# EAGLE design biochem_M_V2 (EAGLE 9.6.2)
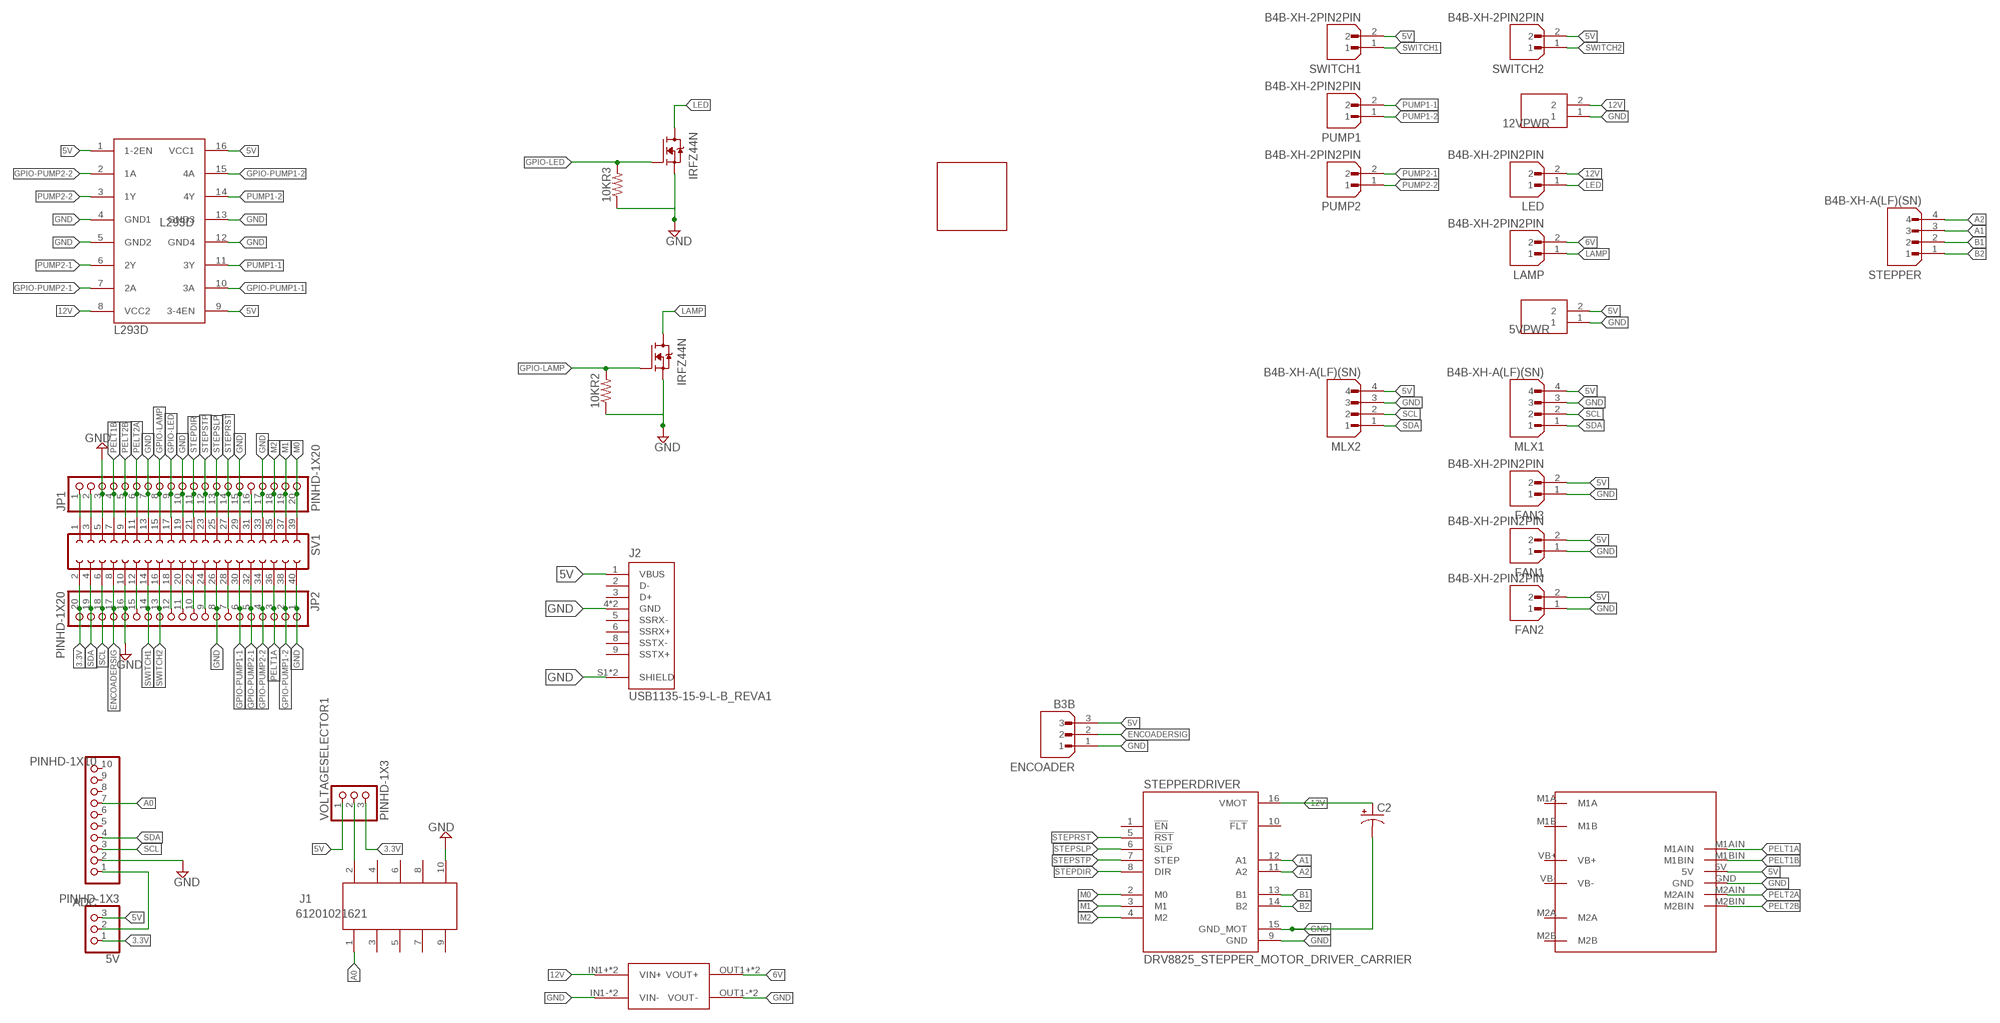
[diagram p0: schematic, sheet 1]

## Parts
5V  PINHD-1X3  [1X03]
5VPWR  TB010-508-02BE  [CUI_TB010-508-02BE]
10KR2  R-US_0204/7  [0204/7]
10KR3  R-US_0204/7  [0204/7]
12VPWR  TB010-508-02BE  [CUI_TB010-508-02BE]
ADC  PINHD-1X10  [1X10]
C2  CPOL-USB45181A  [B45181A]
ENCOADER  B3B  [B3B]
FAN1  B4B-XH-2PIN2PIN  [B4BXH2]
FAN2  B4B-XH-2PIN2PIN  [B4BXH2]
FAN3  B4B-XH-2PIN2PIN  [B4BXH2]
J1  61201021621  [61201021621]
J2  USB1135-15-9-L-B_REVA1  [GCT_USB1135-15-9-L-B_REVA1]
JP1  PINHD-1X20  [1X20]
JP2  PINHD-1X20  [1X20]
L293D  L293D  [DIL16]
LAMP  B4B-XH-2PIN2PIN  [B4BXH2]
LED  B4B-XH-2PIN2PIN  [B4BXH2]
MLX1  B4B-XH-A(LF)(SN)  [JST_B4B-XH-A(LF)(SN)]
MLX2  B4B-XH-A(LF)(SN)  [JST_B4B-XH-A(LF)(SN)]
PUMP1  B4B-XH-2PIN2PIN  [B4BXH2]
PUMP2  B4B-XH-2PIN2PIN  [B4BXH2]
Q4-T  IRFZ44N  [TO254P1016X419X2286-3]
Q4-T4  IRFZ44N  [TO254P1016X419X2286-3]
STEPPER  B4B-XH-A(LF)(SN)  [JST_B4B-XH-A(LF)(SN)]
STEPPERDRIVER  DRV8825_STEPPER_MOTOR_DRIVER_CARRIER  [IC_DRV8825_STEPPER_MOTOR_DRIVER_CARRIER]
SV1  FE20-2  [FE20-2]
SWITCH1  B4B-XH-2PIN2PIN  [B4BXH2]
SWITCH2  B4B-XH-2PIN2PIN  [B4BXH2]
U$1  MP1584  [DC-BRICK]
U$2  MDD3A  [FOOTPRINT]
U$3  QRBIOS  [GITQRBIOSPECTRONICS]
VOLTAGESELECTOR1  PINHD-1X3  [1X03]

## Nets
3.3V [power]: 5V.1 JP2.20 SV1.2 VOLTAGESELECTOR1.3
5V [power]: 5V.3 5VPWR.2 ENCOADER.3 FAN1.2 FAN2.2 FAN3.2 J2.1(VBUS) L293D.1(1-2EN) L293D.9(3-4EN) L293D.16(VCC1) MLX1.4 MLX2.4 SWITCH1.2 SWITCH2.2 U$2.5V VOLTAGESELECTOR1.1
6V: LAMP.2 U$1.OUT1+(VOUT+) U$1.OUT2+(VOUT+)
12V [power]: 12VPWR.2 C2.+ L293D.8(VCC2) LED.2 STEPPERDRIVER.16(VMOT) U$1.IN1+(VIN+) U$1.IN2+(VIN+)
A0: ADC.7 J1.1
A1: STEPPER.3 STEPPERDRIVER.12(A1)
A2: STEPPER.4 STEPPERDRIVER.11(A2)
B1: STEPPER.2 STEPPERDRIVER.13(B1)
B2: STEPPER.1 STEPPERDRIVER.14(B2)
ENCOADERSIG: ENCOADER.2 JP2.17 SV1.8
GND: 5VPWR.1 10KR2.1 10KR3.1 12VPWR.1 ADC.2 C2.- ENCOADER.1 FAN1.1 FAN2.1 FAN3.1 J1.10 J2.4(GND) J2.7(GND) J2.S1(SHIELD) J2.S2(SHIELD) JP1.3 JP1.7 JP1.10 JP1.15 JP1.17 JP2.1 JP2.8 JP2.16 L293D.4(GND1) L293D.5(GND2) L293D.12(GND4) L293D.13(GND3) MLX1.3 MLX2.3 Q4-T4.3(S) Q4-T.3(S) STEPPERDRIVER.9(GND) STEPPERDRIVER.15(GND_MOT) SV1.5 SV1.10 SV1.13 SV1.19 SV1.26 SV1.29 SV1.33 SV1.40 U$1.IN1-(VIN-) U$1.IN2-(VIN-) U$1.OUT1-(VOUT-) U$1.OUT2-(VOUT-) U$2.GND
GPIO-LAMP: 10KR2.2 JP1.8 Q4-T.1(G) SV1.15
GPIO-LED: 10KR3.2 JP1.9 Q4-T4.1(G) SV1.17
GPIO-PUMP1-1: JP2.6 L293D.10(3A) SV1.30
GPIO-PUMP1-2: JP2.2 L293D.15(4A) SV1.38
GPIO-PUMP2-1: JP2.5 L293D.7(2A) SV1.32
GPIO-PUMP2-2: JP2.4 L293D.2(1A) SV1.34
LAMP: LAMP.1 Q4-T.2(D)
LED: LED.1 Q4-T4.2(D)
M0: JP1.20 STEPPERDRIVER.2(M0) SV1.39
M1: JP1.19 STEPPERDRIVER.3(M1) SV1.37
M2: JP1.18 STEPPERDRIVER.4(M2) SV1.35
N$1: JP1.1 SV1.1
N$2: JP1.2 SV1.3
N$7: JP2.15 SV1.12
N$8: J1.2 VOLTAGESELECTOR1.2
N$10: 5V.2 ADC.1
N$20: JP1.16 SV1.31
N$26: JP2.7 SV1.28
N$28: JP2.9 SV1.24
N$29: JP2.10 SV1.22
N$30: JP2.11 SV1.20
N$31: JP2.12 SV1.18
PELT1A: JP2.3 SV1.36 U$2.M1AIN
PELT1B: JP1.4 SV1.7 U$2.M1BIN
PELT2A: JP1.6 SV1.11 U$2.M2AIN
PELT2B: JP1.5 SV1.9 U$2.M2BIN
PUMP1-1: L293D.11(3Y) PUMP1.2
PUMP1-2: L293D.14(4Y) PUMP1.1
PUMP2-1: L293D.6(2Y) PUMP2.2
PUMP2-2: L293D.3(1Y) PUMP2.1
SCL: ADC.3 JP2.18 MLX1.2 MLX2.2 SV1.6
SDA: ADC.4 JP2.19 MLX1.1 MLX2.1 SV1.4
STEPDIR: JP1.11 STEPPERDRIVER.8(DIR) SV1.21
STEPRST: JP1.14 STEPPERDRIVER.5(!RST) SV1.27
STEPSLP: JP1.13 STEPPERDRIVER.6(!SLP) SV1.25
STEPSTP: JP1.12 STEPPERDRIVER.7(STEP) SV1.23
SWITCH1: JP2.14 SV1.14 SWITCH1.1
SWITCH2: JP2.13 SV1.16 SWITCH2.1
Unconnected: ADC.5 ADC.6 ADC.8 ADC.9 ADC.10 J1.3 J1.4 J1.5 J1.6 J1.7 J1.8 J1.9 J2.2(D-) J2.3(D+) J2.5(SSRX-) J2.6(SSRX+) J2.8(SSTX-) J2.9(SSTX+) STEPPERDRIVER.1(!EN) STEPPERDRIVER.10(!FLT) U$2.M1A U$2.M1B U$2.M2A U$2.M2B U$2.VB+ U$2.VB-

## Library data of the parts
5V VOLTAGESELECTOR1 = Connector:PINHD-1X3: PIN HEADER; CATEGORY: CONNECTOR; SUB-CATEGORY: PIN-HEADER
5VPWR 12VPWR = TB010-508-02BE:TB010-508-02BE: Check prices <https://pricing.snapeda.com/parts/TB010-508-02BE/CUI%20Devices/view-part?ref=eda>; AVAILABILITY: Good; CUI_PURCHASE_URL: https://www.cuidevices.com/product/interconnect/connectors/terminal-blocks/tb010-508-series?utm_source=snapeda.com&utm_medium=referral&utm_campaign=snapedaBOM; DESCRIPTION: 2~24 Poles, Screw Type, Horizontal, 5.08 Pitch, 26~12 (AWG), Terminal Block Connector; MF: CUI Devices; MP: TB010-508-02BE; PACKAGE: None; PRICE: None; PURCHASE-URL: https://pricing.snapeda.com/search/part/TB010-508-02BE/?ref=eda
10KR2 10KR3 = rcl:R-US_: RESISTOR, American symbol; SPICEPREFIX: R
ADC = Connector:PINHD-1X10: PIN HEADER; CATEGORY: CONNECTOR; SUB-CATEGORY: PIN-HEADER
C2 = adafruit:CPOL-US: POLARIZED CAPACITOR, American symbol
ENCOADER = B4B-XH-A_LF__SN_:B3B
FAN1-FAN3 LAMP LED PUMP1 PUMP2 SWITCH1 SWITCH2 = B4B-XH-A_LF__SN_:B4B-XH-2PIN: Check availability <https://pricing.snapeda.com/parts/B4B-XH-A%20%20%28LF%29%28SN%29/JST/view-part?ref=eda>
J1 = 61201021621:61201021621: WR-BHD 2.54mm Male Box Header, 10 Pins=>Code : Con_WTB_BHD_2.54_Male_THT_WS_61201021621 <http://katalog.we-online.de/media/thumbs2/eican/thb_Con_WTB_BHD_2.54_Male_THT_WS_6120xx21621_pf2.jpg> Details see: http://katalog.we-online.de/en/em/612_0xx_216_21 Created 2014-06-04, Karrer Zheng 2014 (C) Würth Elektronik Check availability <https://pricing.snapeda.com/parts/61201021621/Wurth%20Elektronik/view-part?ref=eda>; AVAILABILITY: In Stock; DESCRIPTION: Connector Header Through Hole 10 position 0.100 (2.54mm); MF: Wurth Elektronik; MP: 61201021621; PACKAGE: None; PRICE: None; PURCHASE-URL: https://pricing.snapeda.com/search/part/61201021621/?ref=eda
J2 = USB1135-15-9-L-B_REVA1:USB1135-15-9-L-B_REVA1: Check availability <https://pricing.snapeda.com/parts/USB1135-15-9-L-B/Global%20Connector%20Technology/view-part?ref=eda>; AVAILABILITY: In Stock; DESCRIPTION: USB 3.0 type A Connector Full size Horizontal Plug, 6.95mm profile, 9 Pins, Through hole, Top mount, High mating cycle, charging receptacle; MF: Global Connector Technology; MP: USB1135-15-9-L-B; PACKAGE: None; PRICE: None
JP1 JP2 = Connector:PINHD-1X20: PIN HEADER; CATEGORY: CONNECTOR; SUB-CATEGORY: PIN-HEADER
L293D = st-microelectronics:L293D: PUSH-PULL 4 CHANNEL DRIVER; MPN: L293D; OC_FARNELL: 9589619; OC_NEWARK: 56P8249
MLX1 MLX2 STEPPER = B4B-XH-A_LF__SN_:B4B-XH-A(LF)(SN): Check availability <https://pricing.snapeda.com/parts/B4B-XH-A%20%20%28LF%29%28SN%29/JST/view-part?ref=eda>; AVAILABILITY: In Stock; DESCRIPTION: HEADER, VERTICAL, 4WAY; Pitch Spacing: 2.5mm; No. of Contacts: 4Contacts; Gender: Header; Product Range: XH Series; Contact Termination Type: Through Hole; No. of Rows: 1Rows; Contact Plating: Tin Plated Contacts; Contact Material: Brass; SVHC: No SVHC (17-Dec-2015); Contact Resistance: 10mohm; Current Rating: 3A; Insulation Resistance: 1000Mohm; Operating Temperature Max: 85°C; Operating Temperature Min: -25°C; Voltage Rating VAC: 250V; Wire Size AWG Max: 22AWG; Wire Size AWG Min: 30AWG; Withstand Voltage: 1000V; MF: JST; MP: B4B-XH-A (LF)(SN); PACKAGE: None; PRICE: None; PURCHASE-URL: https://pricing.snapeda.com/search/part/B4B-XH-A (LF)(SN)/?ref=eda
Q4-T Q4-T4 = IRFZ44N:IRFZ44N: Check availability <https://pricing.snapeda.com/parts/IRFZ44N/Infineon%20Technologies/view-part?ref=eda>; AVAILABILITY: In Stock; DESCRIPTION: N-Channel 55 V 49A (Tc) 94W (Tc) Through Hole TO-220AB; MF: Infineon Technologies; MP: IRFZ44N; PACKAGE: TO-220-3 Infineon; PRICE: None; PURCHASE-URL: https://pricing.snapeda.com/search/part/IRFZ44N/?ref=eda
STEPPERDRIVER = DRV8825_STEPPER_MOTOR_DRIVER_CARRIER:DRV8825_STEPPER_MOTOR_DRIVER_CARRIER: Stepper motor controler; IC: DRV8825; 1.5A; Uin mot: 8.2÷45V Check availability <https://pricing.snapeda.com/parts/DRV8825%20STEPPER%20MOTOR%20DRIVER%20CARRIER/Pololu/view-part?ref=eda>; AVAILABILITY: Not in stock; DESCRIPTION: Stepper, Bipolar 8.2 ~ 45VDC Supply 1.5A 8.2 ~ 45V Load; MF: Pololu; MP: DRV8825 STEPPER MOTOR DRIVER CARRIER; PACKAGE: None; PRICE: None
SV1 = 20 pin rpi connector:FE20-2: FEMALE HEADER; OC_FARNELL: unknown; OC_NEWARK: unknown
U$1 = mp1584:MP1584: MP1584-dc-brick-pcb Step down Input: 4.5V - 28V Ouput 0.8V - 25V max. 3A Cheap on ebay
U$2 = MDD3A:MDD3A
U$3 = Logo:QRBIOS

## Net classes
1 power: width 1.016 mm

## Board
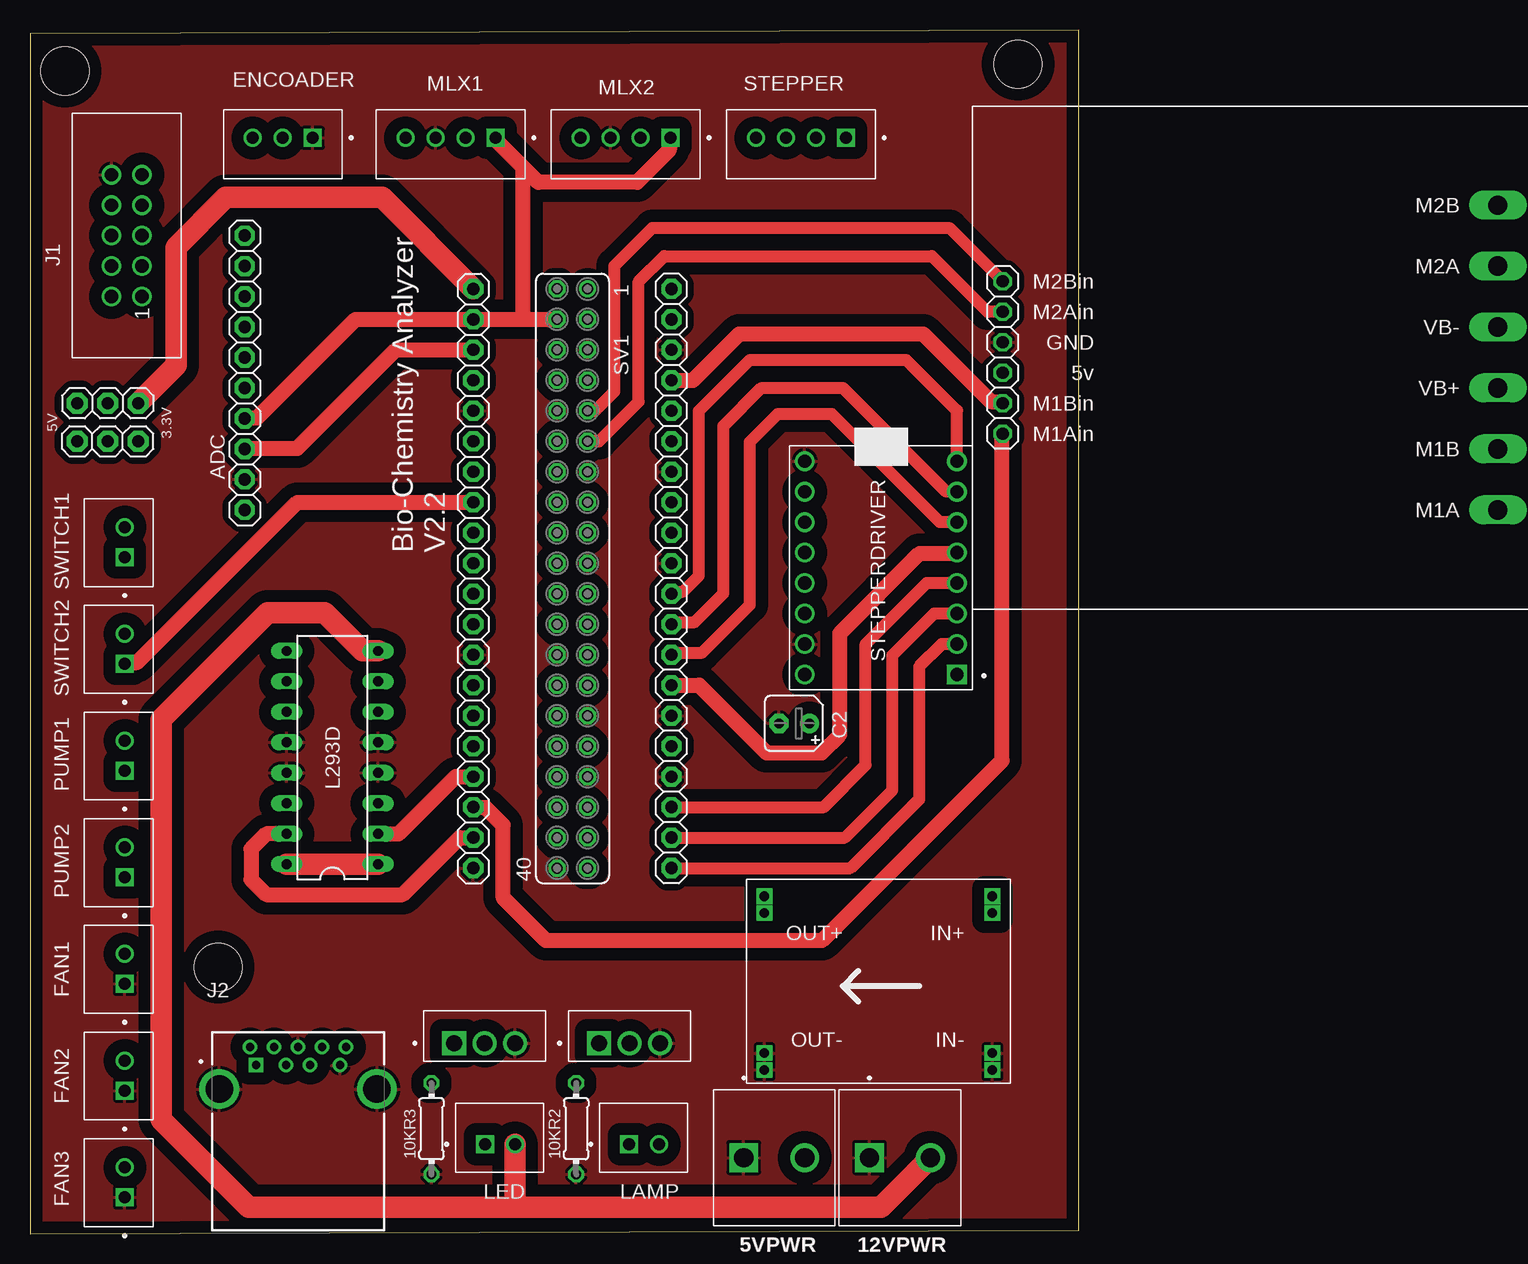
[diagram p1: board, top side]
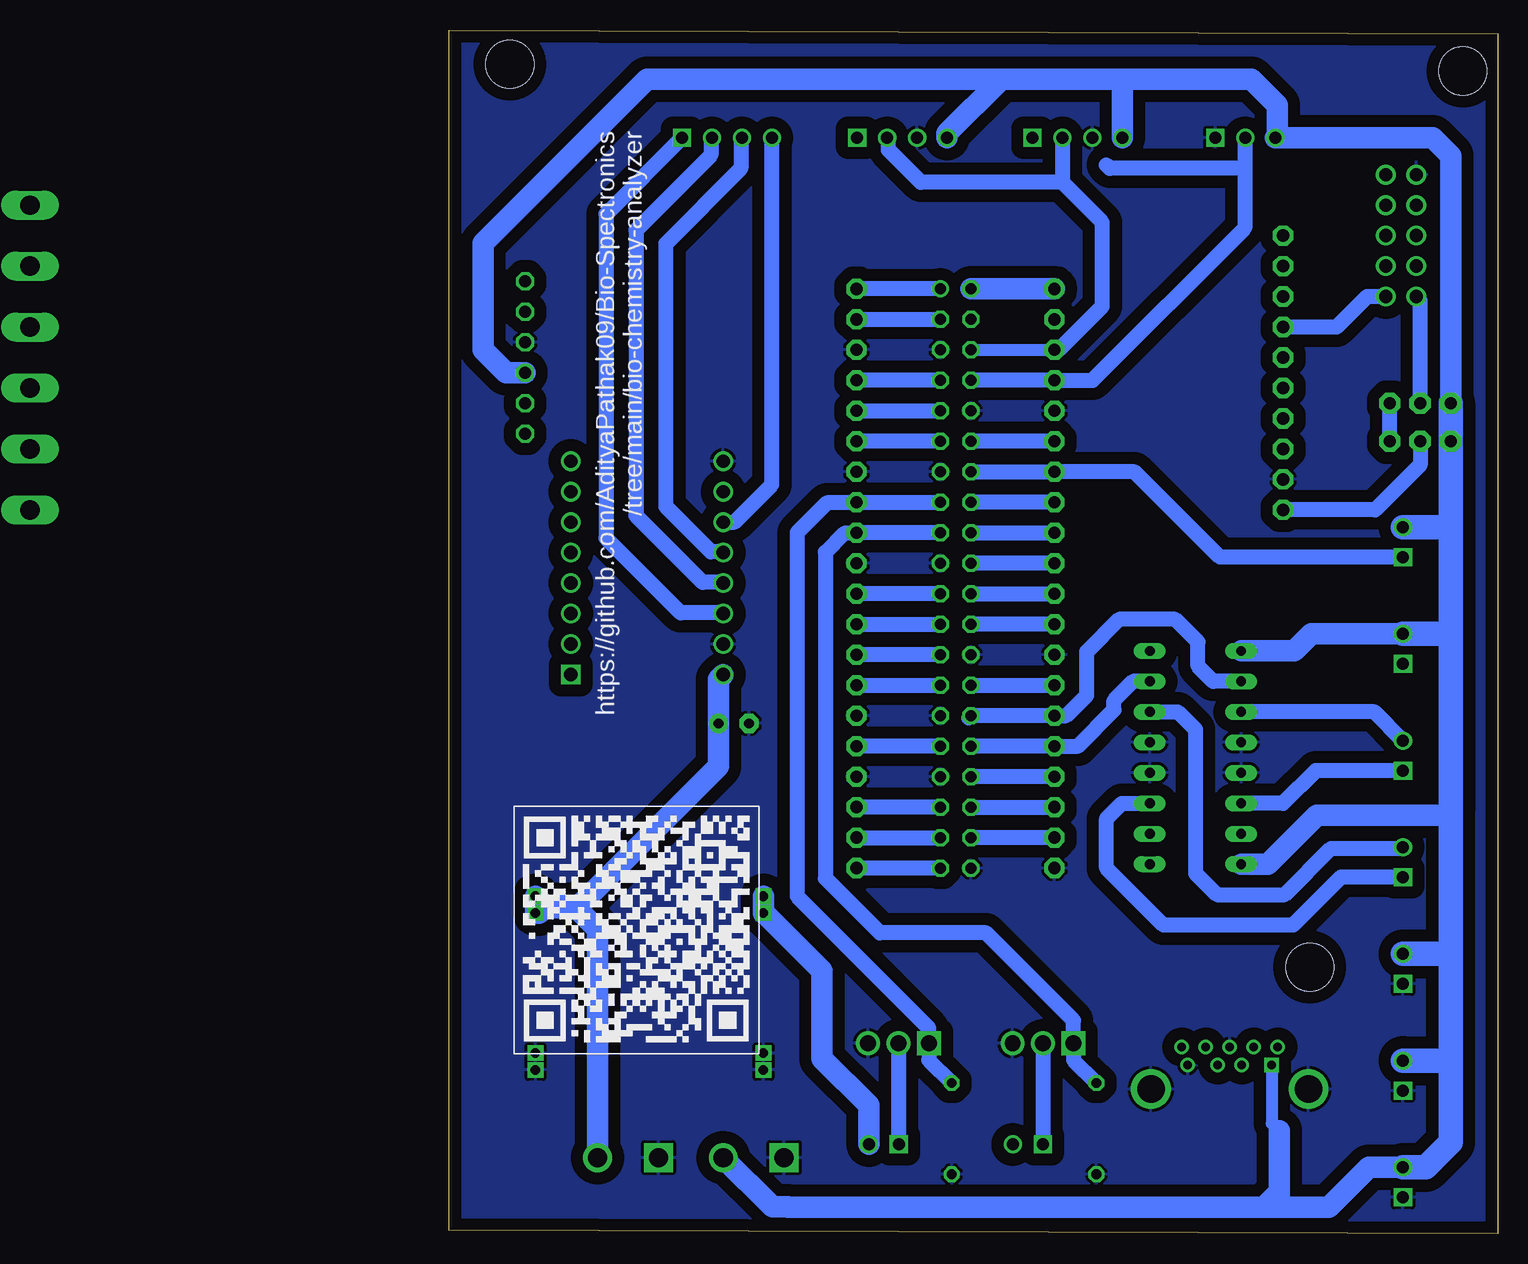
[diagram p2: board, bottom side, seen from below]

Size 87.42 x 100.32 mm. Coordinates in mm from the lower left corner, seen from the top.
Outline: 0,0 87.42,0.32 87.42,100.32 0,100 0,0
Copper layers (1*16): Top 0.035mm / dielectric 1.5mm / Bottom 0.035mm
Design rules "default *": minimum track width 40mil, minimum drill 0.35mm, track to track 40mil, track to pad 40mil, pad to pad 10mil, via to via 40mil, smd to smd 40mil, copper to edge 40mil, drill to drill 6mil, minimum pad ring 10mil, minimum via ring 8mil, stop-mask expansion 4mil, vias tented up to drill 0mil, thermal gap 10mil
Holes 4 mm at 2.92,96.9 15.68,22.23 82.36,97.47

### Footprints (pad centres in the part's own frame; a part is rotated, then mirrored left to right if it is on the bottom)
1X03 = drill 1.016 pad 1.778 octagon: 1 -2.54,0; 2 0,0; 3 2.54,0
CUI_TB010-508-02BE = drill 1.6 square: 1 0,0 | drill 1.6: 2 5.08,0
0204/7 = drill 0.813 octagon: 1 -3.81,0; 2 3.81,0
1X10 = drill 1.016 pad 1.676 octagon: 1 -11.43,0; 2 -8.89,0; 3 -6.35,0; 4 -3.81,0; 5 -1.27,0; 6 1.27,0; 7 3.81,0; 8 6.35,0; 9 8.89,0; 10 11.43,0
B45181A = drill 0.813 pad 1.6: + -1.27,0 | drill 0.813 pad 1.6 octagon: - 1.27,0
B3B = drill 1 square: 1 -2.48,-1.795 | drill 1: 2 0.02,-1.795; 3 2.52,-1.795
B4BXH2 = drill 1 square: 1 -1.4,0.475 | drill 1: 2 1.1,0.475
61201021621 = drill 1.1: 1 -5.08,-1.27; 2 -5.08,1.27; 3 -2.54,-1.27; 4 -2.54,1.27; 5 0,-1.27; 6 0,1.27; 7 2.54,-1.27; 8 2.54,1.27; 9 5.08,-1.27; 10 5.08,1.27
GCT_USB1135-15-9-L-B_REVA1 = drill 0.7 square: 1 -3.5,2 | drill 0.7: 2 -1,2; 3 1,2; 4 3.5,2; 5 4,3.5; 6 2,3.5; 7 0,3.5; 8 -2,3.5; 9 -4,3.5 | drill 2.3: S1 -6.57,0; S2 6.57,0
1X20 = drill 1.016 pad 1.676 octagon: 1 -24.13,0; 2 -21.59,0; 3 -19.05,0; 4 -16.51,0; 5 -13.97,0; 6 -11.43,0; 7 -8.89,0; 8 -6.35,0; 9 -3.81,0; 10 -1.27,0; 11 1.27,0; 12 3.81,0; 13 6.35,0; 14 8.89,0; 15 11.43,0; 16 13.97,0; 17 16.51,0; 18 19.05,0; 19 21.59,0; 20 24.13,0
DIL16 = drill 0.813 long: 1 -8.89,-3.81; 2 -6.35,-3.81; 3 -3.81,-3.81; 4 -1.27,-3.81; 5 1.27,-3.81; 6 3.81,-3.81; 7 6.35,-3.81; 8 8.89,-3.81; 9 8.89,3.81; 10 6.35,3.81; 11 3.81,3.81; 12 1.27,3.81; 13 -1.27,3.81; 14 -3.81,3.81; 15 -6.35,3.81; 16 -8.89,3.81
JST_B4B-XH-A(LF)(SN) = drill 1 square: 1 -3.75,-0.525 | drill 1: 2 -1.25,-0.525; 3 1.25,-0.525; 4 3.75,-0.525
TO254P1016X419X2286-3 = drill 1.33 square: 1 -2.54,0 | drill 1.33: 2 0,0; 3 2.54,0
IC_DRV8825_STEPPER_MOTOR_DRIVER_CARRIER = drill 1.1 square: 1 -6.35,8.89 | drill 1.1: 2 -6.35,6.35; 3 -6.35,3.81; 4 -6.35,1.27; 5 -6.35,-1.27; 6 -6.35,-3.81; 7 -6.35,-6.35; 8 -6.35,-8.89; 9 6.35,-8.89; 10 6.35,-6.35; 11 6.35,-3.81; 12 6.35,-1.27; 13 6.35,1.27; 14 6.35,3.81; 15 6.35,6.35; 16 6.35,8.89
FE20-2 = drill 0.914: 1 -24.13,1.27 | drill 0.914 octagon: 2 -24.13,-1.27; 3 -21.59,1.27; 4 -21.59,-1.27; 5 -19.05,1.27; 6 -19.05,-1.27; 7 -16.51,1.27; 8 -16.51,-1.27; 9 -13.97,1.27; 10 -13.97,-1.27; 11 -11.43,1.27; 12 -11.43,-1.27; 13 -8.89,1.27; 14 -8.89,-1.27; 15 -6.35,1.27; 16 -6.35,-1.27; 17 -3.81,1.27; 18 -3.81,-1.27; 19 -1.27,1.27; 20 -1.27,-1.27; 21 1.27,1.27; 22 1.27,-1.27; 23 3.81,1.27; 24 3.81,-1.27; 25 6.35,1.27; 26 6.35,-1.27; 27 8.89,1.27; 28 8.89,-1.27; 29 11.43,1.27; 30 11.43,-1.27; 31 13.97,1.27; 32 13.97,-1.27; 33 16.51,1.27; 34 16.51,-1.27; 35 19.05,1.27; 36 19.05,-1.27; 37 21.59,1.27; 38 21.59,-1.27; 39 24.13,1.27; 40 24.13,-1.27
DC-BRICK = drill 0.8 square: IN1+ 1.5,1.4; IN1- 1.5,14.47; IN2+ 1.5,2.8; IN2- 1.5,15.87; OUT1+ 20.5,1.4; OUT1- 20.5,14.47; OUT2+ 20.5,2.8; OUT2- 20.5,15.87
FOOTPRINT = drill 1.016 octagon: 5V 45.72,22.225; GND 45.72,19.685; M1AIN 45.72,27.305; M1BIN 45.72,24.765; M2AIN 45.72,17.145; M2BIN 45.72,14.605 | drill 1.6 long: M1A 4.445,33.655; M1B 4.445,28.575; M2A 4.445,13.335; M2B 4.445,8.255; VB+ 4.445,23.495; VB- 4.445,18.415

### Placement (x,y rotation side)
5V  6.48,66.04 180 top
5VPWR  59.5,6.35 0 top
10KR2  45.53,8.76 90 top
10KR3  33.46,8.76 90 top
12VPWR  69.98,6.35 0 top
ADC  17.91,71.76 90 top
C2  63.7,42.53 180 top
ENCOADER  21.08,89.54 180 top
FAN1  8.38,22.23 90 top
FAN2  8.38,13.33 90 top
FAN3  8.38,4.45 90 top
J1  8.06,83.19 90 top
J2  22.35,12.06 0 top
JP1  53.47,54.61 270 top
JP2  36.96,54.61 90 top
L293D  25.21,39.69 90 top
LAMP  51.35,6.99 0 top
LED  39.33,6.99 0 top
MLX1  35.05,90.81 180 top
MLX2  49.66,90.81 180 top
PUMP1  8.38,40 90 top
PUMP2  8.38,31.12 90 top
Q4-T  49.97,15.88 0 top
Q4-T4  37.91,15.88 0 top
STEPPER  64.26,90.81 180 top
STEPPERDRIVER  70.93,55.5 180 top
SV1  45.21,54.61 270 top
SWITCH1  8.38,57.78 90 top
SWITCH2  8.38,48.89 90 top
U$1  81.72,29.53 180 top
U$2  126.81,93.98 180 top
U$3  82.03,35.61 180 top
VOLTAGESELECTOR1  6.48,69.22 0 top

### Tracks (layer width: path | path; a pad name or v marks a point on that pad's centre or on a via)
3.3V
  Top 1.778: VOLTAGESELECTOR1.3 12.19,72.39 12.19,82.23 16.32,86.36 29.34,86.36 JP2.20
  Bottom 1.27: 5V.1 VOLTAGESELECTOR1.3
  Bottom 1.778: JP2.20 SV1.2
5V
  Top 1.778: L293D.16 L293D.1
  Bottom 1.016: J2.1 18.85,9.21 18.22,8.57 18.22,3.5
  Bottom 1.778: 5VPWR.2 60.47,2.24 59.16,2.24 59.18,2.22 19.49,2.22 | 18.54,2.22 14.1,2.22 10.77,5.55 FAN3.2 | 18.54,2.22 19.49,2.22 | VOLTAGESELECTOR1.1 3.94,89.85 5.41,91.33 18.4,91.33 | 41.4,96.2 31.24,96.2 | 31.24,96.2 20.56,96.2 18.4,94.05 18.4,91.33 | MLX2.4 45.91,91.7 41.4,96.2 | MLX1.4 31.3,96.14 31.24,96.2 | L293D.16 19.18,30.8 15.1,34.87 4.31,34.87 3.94,35.24 | SWITCH2.2 15.54,50 16.95,48.58 L293D.9 | 18.22,3.5 19.49,2.22 | 18.54,2.22 18.22,2.55 18.22,8.57 | 41.4,96.2 70.93,96.2 84.58,82.55 84.58,73.66 82.68,71.76 U$2.5V | ENCOADER.3 18.4,91.33
  Bottom 2.032: SWITCH1.2 4.4,58.89 3.94,58.42 | 3.94,58.42 3.94,50.17 | SWITCH2.2 4.11,50 3.94,50.17 | VOLTAGESELECTOR1.1 5V.3 3.94,58.42 | FAN1.2 4.08,23.33 3.94,23.18 | FAN3.2 6.01,5.55 3.94,7.62 3.94,14.61 | 3.94,14.61 3.94,23.18 | FAN2.2 4.11,14.44 3.94,14.61 | 3.94,23.18 3.94,35.24 3.94,50.17
6V
  Bottom 1.778: U$1.OUT1+ U$1.OUT2+ 61.14,26.73 56.32,21.91 56.32,14.61 52.45,10.73 LAMP.2
12V
  Top 1.778: LED.2 40.43,2.22 | L293D.8 27.75,48.58 24.57,51.75 19.81,51.75 10.92,42.86 10.92,9.53 18.22,2.22 40.43,2.22 | 40.43,2.22 70.93,2.22 12VPWR.2
  Bottom 1.778: STEPPERDRIVER.16 64.97,46.22 C2.+ 64.97,38.98 76.77,27.18 79.27,27.18 U$1.IN1+ U$1.IN2+ 79.91,26.73 79.27,27.36 77.05,27.36 75.06,25.37 12VPWR.2
A0
  Bottom 1.27: ADC.7 13.46,75.57 10.92,78.11 J1.1
A1
  Bottom 1.27: STEPPER.3 63.11,91.24 63.11,88.78 69.36,82.52 69.36,60.59 65.6,56.83 64.64,56.83 STEPPERDRIVER.12
A2
  Bottom 1.27: STEPPER.4 60.51,62.42 62.1,60.83 62.1,60.82 63.62,59.31 STEPPERDRIVER.11
B1
  Bottom 1.27: STEPPERDRIVER.13 64.64,54.29 66.3,54.29 71.86,59.86 71.86,83.64 65.61,89.89 65.61,91.24 STEPPER.2
B2
  Bottom 1.27: STEPPERDRIVER.14 64.64,51.75 68.13,51.75 74.36,57.98 74.36,84.98 STEPPER.1
ENCOADERSIG
  Bottom 1.27: 32.65,89.08 32.35,88.79 21.21,88.79 21.1,88.9 | SV1.8 JP2.17 33.78,71.12 21.1,83.8 21.1,88.9 | ENCOADER.2 21.1,91.29 21.1,88.9
GND
  pour Bottom: 0.13,100.01 0.13,0 87.12,0 87.12,100.01
  pour Top: 0.13,100.33 0.13,0 87.12,0 87.12,100.33
GPIO-LAMP
  Bottom 1.27: SV1.15 JP1.8 53.52,60.91 55.94,60.91 58.42,58.43 58.42,28.13 47.43,17.15 Q4-T.1 47.43,14.48 10KR2.2
GPIO-LED
  Bottom 1.27: SV1.17 JP1.9 53.52,58.37 54.5,58.37 56.07,56.8 56.07,29.62 51.53,25.08 42.67,25.08 35.37,17.78 Q4-T4.1 35.37,14.48 10KR3.2
GPIO-PUMP1-1
  Bottom 1.27: 44.12,43 SV1.30 JP2.6 35.98,43.18 34.28,44.88 34.28,48.52 31.59,51.21 26.89,51.21 25.01,49.33 25.01,47.3 23.74,46.04 L293D.10
GPIO-PUMP1-2
  Top 1.27: L293D.15 19.69,33.34 18.43,32.07 18.43,29.52 19.69,28.26 31.04,28.26 35.81,33.02 JP2.2
  Bottom 1.27: JP2.2 SV1.38
GPIO-PUMP2-1
  Bottom 1.27: SV1.32 JP2.5 35.01,40.64 31.99,43.66 31.99,44.46 30.41,46.04 L293D.7
GPIO-PUMP2-2
  Top 1.27: L293D.2 30.73,33.34 35.49,38.1 JP2.4
  Bottom 1.27: JP2.4 SV1.34
LAMP
  Bottom 1.27: Q4-T.2 49.97,7.49 LAMP.1
LED
  Bottom 1.27: Q4-T4.2 37.91,7.48 LED.1
M0
  Top 1.016: JP1.20 68.39,30.48 74.1,36.2 74.1,47.24 76.01,49.15 STEPPERDRIVER.2
  Bottom 1.27: SV1.39 JP1.20
M1
  Top 1.016: STEPPERDRIVER.3 75.37,51.69 71.88,48.2 71.88,36.98 67.93,33.02 JP1.19
  Bottom 1.27: JP1.19 SV1.37
M2
  Top 1.016: STEPPERDRIVER.4 74.74,54.23 69.66,49.15 69.66,39.05 66.17,35.56 JP1.18
  Bottom 1.27: SV1.35 JP1.18
N$1
  Bottom 1.27: SV1.1 JP1.1
N$2
  Bottom 1.27: JP1.2 SV1.3
N$7
  Bottom 1.27: JP2.15 SV1.12
N$8
  Bottom 1.27: VOLTAGESELECTOR1.2 6.48,77.79 J1.2
N$10
  Bottom 1.27: 5V.2 6.48,64.09 10.24,60.33 ADC.1
N$20
  Bottom 1.27: SV1.31 JP1.16
N$26
  Bottom 1.27: SV1.28 JP2.7
N$28
  Bottom 1.27: JP2.9 SV1.24
N$29
  Bottom 1.27: SV1.22 JP2.10
N$30
  Bottom 1.27: JP2.11 SV1.20
N$31
  Bottom 1.27: SV1.18 JP2.12
PELT1A
  Top 1.27: U$2.M1AIN 81.03,66.61 81.03,39.43 66.02,24.42 43.01,24.42 39.45,27.99 39.45,34.05 37.99,35.51 37.01,35.51 JP2.3
  Bottom 1.27: SV1.36 JP2.3
PELT1B
  Top 1.27: JP1.4 55.25,71.12 59.13,74.99 74.44,74.99 80.09,69.34 80.96,69.34 U$2.M1BIN
  Bottom 1.27: SV1.7 JP1.4
PELT2A
  Top 1.016: SV1.11 46.49,66.03 47.42,66.03 50.75,69.35 50.75,79.36 52.86,81.47 75.18,81.47 79.82,76.84 U$2.M2AIN
  Bottom 1.27: SV1.11 JP1.6
PELT2B
  Top 1.016: SV1.9 47.1,68.58 48.72,70.19 48.72,80.66 51.88,83.82 76.64,83.82 U$2.M2BIN
  Bottom 1.27: JP1.5 SV1.9
PUMP1-1
  Bottom 1.27: PUMP1.2 10.3,43.5 L293D.11
PUMP1-2
  Bottom 1.27: PUMP1.1 15.18,38.61 17.91,35.88 L293D.14
PUMP2-1
  Bottom 1.27: L293D.6 26.68,43.5 25.21,42.03 25.21,30.04 23.42,28.26 17.77,28.26 13.91,32.12 8,32.12 PUMP2.2
PUMP2-2
  Bottom 1.27: PUMP2.1 13.08,29.72 17.08,25.72 27.87,25.72 32.63,30.48 32.63,34.61 31.36,35.88 L293D.3
SCL
  Top 1.27: ADC.3 17.96,65.46 22.28,65.46 30.48,73.66 JP2.18
  Bottom 1.016: SV1.6 JP2.18 | 50.93,91.31 MLX2.2
  Bottom 1.27: JP2.18 36.91,73.71 36.56,73.71 32.99,77.28 32.99,84.3 36.32,87.63 | 50.93,91.31 50.81,91.2 50.81,90.33 48.11,87.63 36.32,87.63 | MLX1.2 36.32,91.31 36.32,87.63
SDA
  Top 1.27: MLX2.1 53.31,91.24 53.31,90.33 50.61,87.63 42.35,87.63 41.08,88.9 | 41.08,88.9 38.8,91.18 MLX1.1 | 41.08,76.2 JP2.19 27.14,76.2 18.94,68 17.96,68 ADC.4 | 41.08,76.2 SV1.4 | 41.08,76.2 41.08,88.9
STEPDIR
  Top 1.016: JP1.11 53.64,53.52 54.45,53.52 55.77,54.84 55.77,68.58 60.02,72.83 73.04,72.83 77.28,68.6 STEPPERDRIVER.8
  Bottom 1.27: SV1.21 JP1.11
STEPRST
  Top 1.27: STEPPERDRIVER.5 77.22,56.71 74.16,56.71 67.5,50.04 67.5,41.6 65.99,40.08 61.42,40.08 55.78,45.72 JP1.14
  Bottom 1.27: JP1.14 SV1.27
STEPSLP
  Top 1.016: JP1.13 53.64,48.44 56.03,48.44 60.01,52.41 60.01,66 62.34,68.33 66.82,68.33 75.84,59.31 STEPPERDRIVER.6
  Bottom 1.27: SV1.25 JP1.13
STEPSTP
  Top 1.016: JP1.12 53.64,50.98 55.4,50.98 57.8,53.38 57.8,67.3 60.99,70.49 67.75,70.49 76.39,61.85 STEPPERDRIVER.7
  Bottom 1.27: JP1.12 SV1.23
SWITCH1
  Bottom 1.27: SV1.14 JP2.14 30.29,63.5 23.17,56.39 SWITCH1.1
SWITCH2
  Top 1.27: SWITCH2.1 8,47.59 8.9,47.59 22.27,60.96 JP2.13
  Bottom 1.27: JP2.13 SV1.16

### Text on the board
tNames: 3.3V | 5V | Bio-Chemistry Analyzer / V2.2
bNames: https://github.com/AdityaPathak09/Bio-Spectronics / /tree/main/bio-chemistry-analyzer